# EAGLE design 32sog (EAGLE 7.3.0)
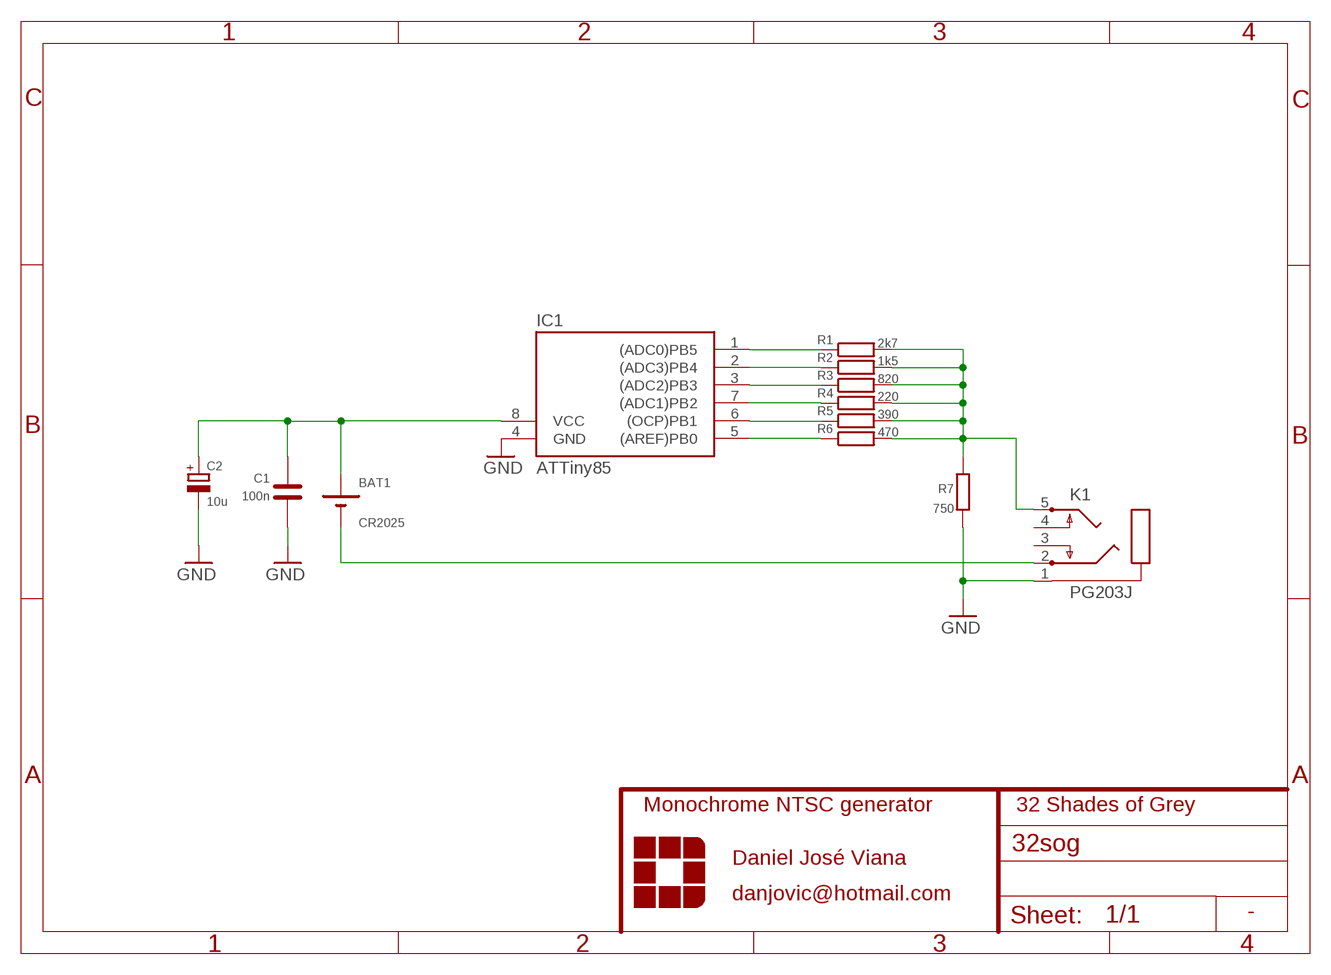
[diagram p0: schematic, sheet 1]

## Parts
BAT1  CR2025  CR2032H1GJ00245  [CR2032-1GJ00245]
C1  100n  CCERAMICO  [C050-024X044]
C2  10u  CPOL-EUE2-4_LARGEPADS  [E2-4_LARGEPADS]
IC1  ATTiny85  TINY15LP  [DIL08]
K1  PG203J  [PG203J]
R1  2k7  R-EU_0207/7  [0207/7]
R2  1k5  R-EU_0207/7  [0207/7]
R3  820  R-EU_0207/7  [0207/7]
R4  390  R-EU_0207/7  [0207/7]
R5  220  R-EU_0207/7  [0207/7]
R6  470  R-EU_0207/7  [0207/7]
R7  750  R-EU_0207/7  [0207/7]

## Nets
GND: C1.1 C2.- IC1.4(GND) K1.1 R7.2
N$1: IC1.1((ADC0)PB5) R1.1
N$2: IC1.3((ADC2)PB3) R3.1
N$3: BAT1.PLUS C1.2 C2.+ IC1.8(VCC)
N$4: IC1.6((OCP)PB1) R5.1
N$5: IC1.2((ADC3)PB4) R2.1
N$6: IC1.7((ADC1)PB2) R4.1
N$7: IC1.5((AREF)PB0) R6.1
N$8: K1.5 R1.2 R2.2 R3.2 R4.2 R5.2 R6.2 R7.1
N$9: BAT1.MINUS K1.2
Unconnected: K1.3 K1.4

## Notes on the sheet
- Monochrome NTSC generator | 32 Shades of Grey
- Daniel José Viana
- danjovic@hotmail.com
- -

## Library data of the parts
BAT1 = diversos2:CR2032H: LI BATTERY Varta
C1 = diversos2:C*
C2 = rcl:CPOL-EU: POLARIZED CAPACITOR, European symbol
IC1 = atmel:TINY15L: MICROCONTROLLER 2.7 V 1 Kbytes FLASH 64 bytes EEPROM 4-channel 10 bit ADC; OC_FARNELL: unknown; OC_NEWARK: unknown
K1 = con-hirschmann:PG203J: MIC/HEADPHONE JACK KS-S stereo microphone/headphone jack PG203JN (Schukat); OC_FARNELL: unknown; OC_NEWARK: unknown
R1-R7 = rcl:R-EU_: RESISTOR, European symbol

## Board
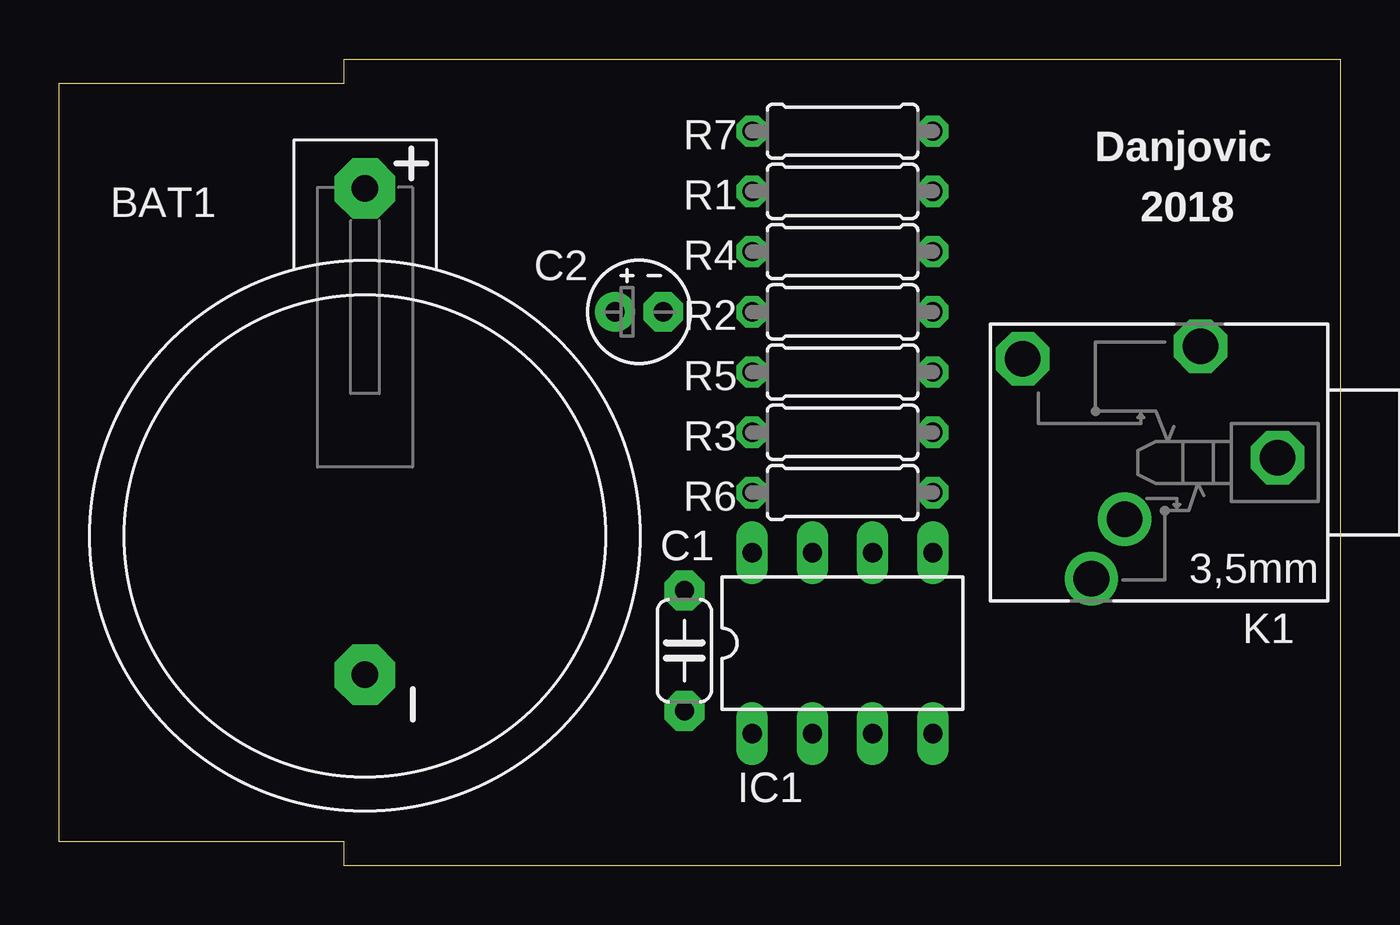
[diagram p1: board, top side]
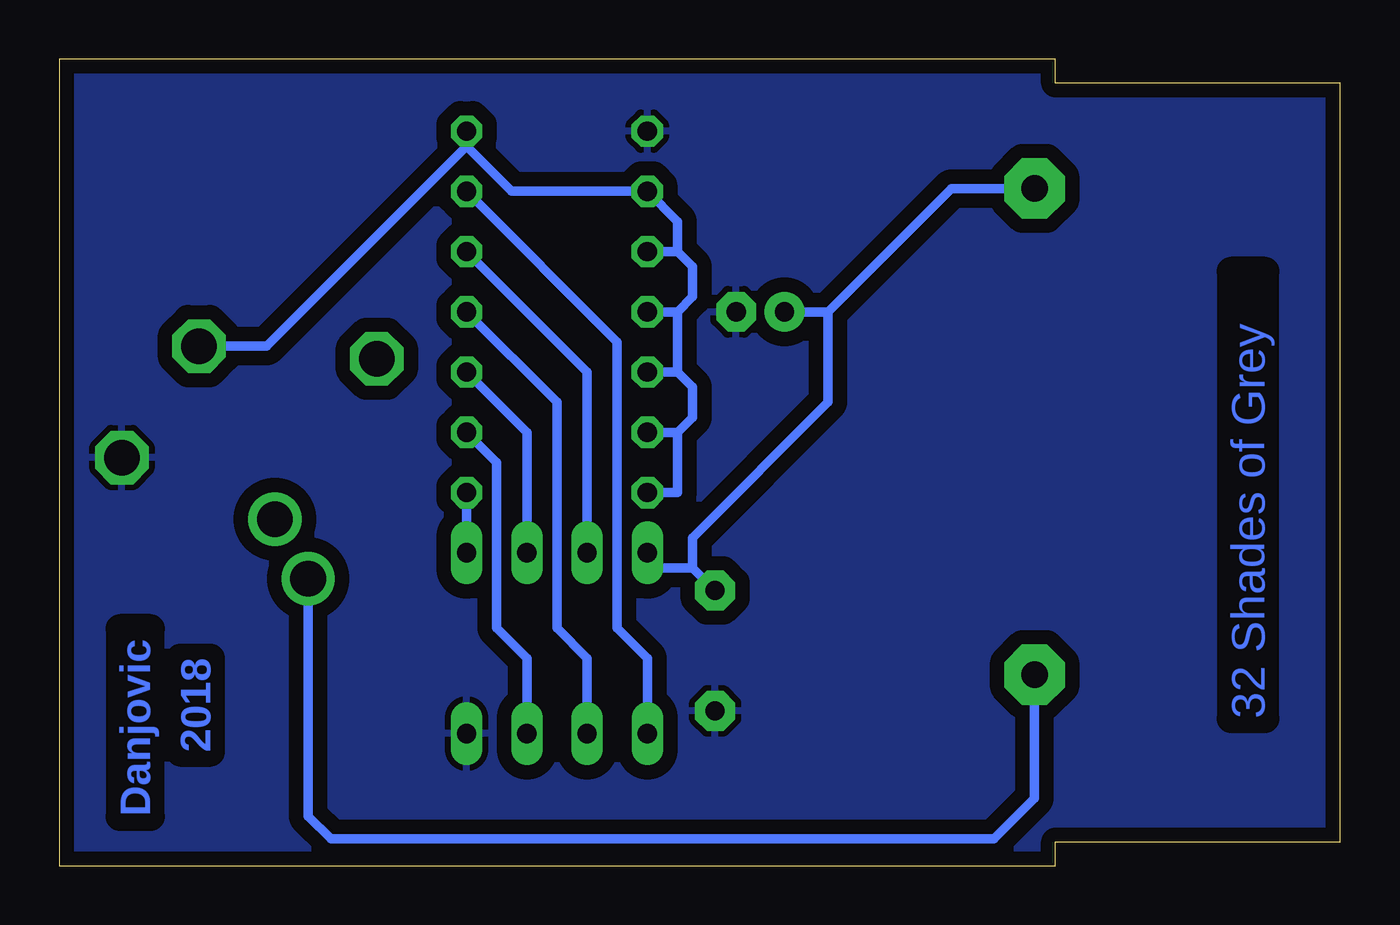
[diagram p2: board, bottom side, seen from below]

Size 54 x 34 mm. Coordinates in mm from the lower left corner, seen from the top.
Copper layers (1*16): Top 0.035mm / dielectric 1.5mm / Bottom 0.035mm
Design rules "default *": minimum track width 10mil, minimum drill 24mil, track to track 8mil, track to pad 8mil, pad to pad 8mil, via to via 8mil, smd to smd 8mil, copper to edge 20mil, drill to drill 8mil, minimum pad ring 10mil, minimum via ring 8mil, stop-mask expansion 4mil, vias tented up to drill 0mil, thermal gap 10mil

### Footprints (pad centres in the part's own frame; a part is rotated, then mirrored left to right if it is on the bottom)
CR2032-1GJ00245 = drill 1.118 pad 2.54 octagon: MINUS 5.85,0; PLUS -14.65,0
C050-024X044 = drill 0.8 pad 1.676 octagon: 1 -2.54,0; 2 2.54,0
E2-4_LARGEPADS = drill 0.813 pad 1.676: + -1.016,0 | drill 0.813 pad 1.676 octagon: - 1.016,0
DIL08 = drill 0.813 long: 1 -3.81,-3.81; 2 -1.27,-3.81; 3 1.27,-3.81; 4 3.81,-3.81; 5 3.81,3.81; 6 1.27,3.81; 7 -1.27,3.81; 8 -3.81,3.81
PG203J = drill 1.499 octagon: 1 -5.004,-0.203; 4 5.74,-4.369; 5 -1.753,-4.902 | drill 1.499: 2 2.845,4.902; 3 1.448,2.388
0207/7 = drill 0.813 octagon: 1 -3.81,0; 2 3.81,0

### Placement (x,y rotation side)
BAT1  12.89,13.9 270 top
C1  26.35,9.06 90 top
C2  24.45,23.35 0 top
IC1  33.02,9.38 0 top
K1  46.35,17 180 top
R1  33.02,28.43 180 top
R2  33.02,23.35 180 top
R3  33.02,18.27 180 top
R4  33.02,25.89 180 top
R5  33.02,20.81 180 top
R6  33.02,15.73 180 top
R7  33.02,30.97 180 top
U$1  [TIC_TAC_INSET]  0,17 0 top

### Tracks (layer width: path | path; a pad name or v marks a point on that pad's centre or on a via)
GND
  pour Bottom (isolate 0.61): -0.64,34.14 -0.64,-0.15 53.98,-0.15 53.98,34.14
N$1
  Bottom 0.406: IC1.1 29.21,8.74 30.48,10.01 30.48,22.08 R1.1
N$2
  Bottom 0.406: IC1.3 34.29,8.74 35.56,10.01 35.56,17 R3.1
N$3
  Bottom 0.406: IC1.8 29.21,12.55 27.3,12.55 | 27.3,12.55 C1.2 | 27.3,12.55 27.3,13.82 21.59,19.54 21.59,23.35 | BAT1.PLUS 16.39,28.55 21.59,23.35 | C2.+ 21.59,23.35
N$4
  Bottom 0.406: IC1.6 34.29,18.27 R5.1
N$5
  Bottom 0.406: IC1.2 31.75,8.74 33.02,10.01 33.02,19.54 R2.1
N$6
  Bottom 0.406: IC1.7 31.75,20.81 R4.1
N$7
  Bottom 0.406: IC1.5 R6.1
N$8
  Bottom 0.406: R6.2 27.94,15.73 27.94,18.27 | 27.94,18.27 27.3,18.9 27.3,20.17 27.94,20.81 | 27.94,20.81 27.94,23.35 | 27.94,23.35 27.3,23.98 27.3,25.25 27.94,25.89 | 27.94,25.89 27.94,27.16 R1.2 34.92,28.43 36.83,30.33 | R4.2 27.94,25.89 | R2.2 27.94,23.35 | R5.2 27.94,20.81 | R3.2 27.94,18.27 | R7.1 36.83,30.33 | K1.5 45.26,21.9 36.83,30.33
N$9
  Bottom 0.406: K1.2 43.51,2.09 42.55,1.12 14.61,1.12 12.89,2.84 BAT1.MINUS

### Text on the board
Bottom: 2018 | 32 Shades of Grey | Danjovic
tPlace: Danjovic | 2018